# EAGLE design Tester (EAGLE 6.5.0)
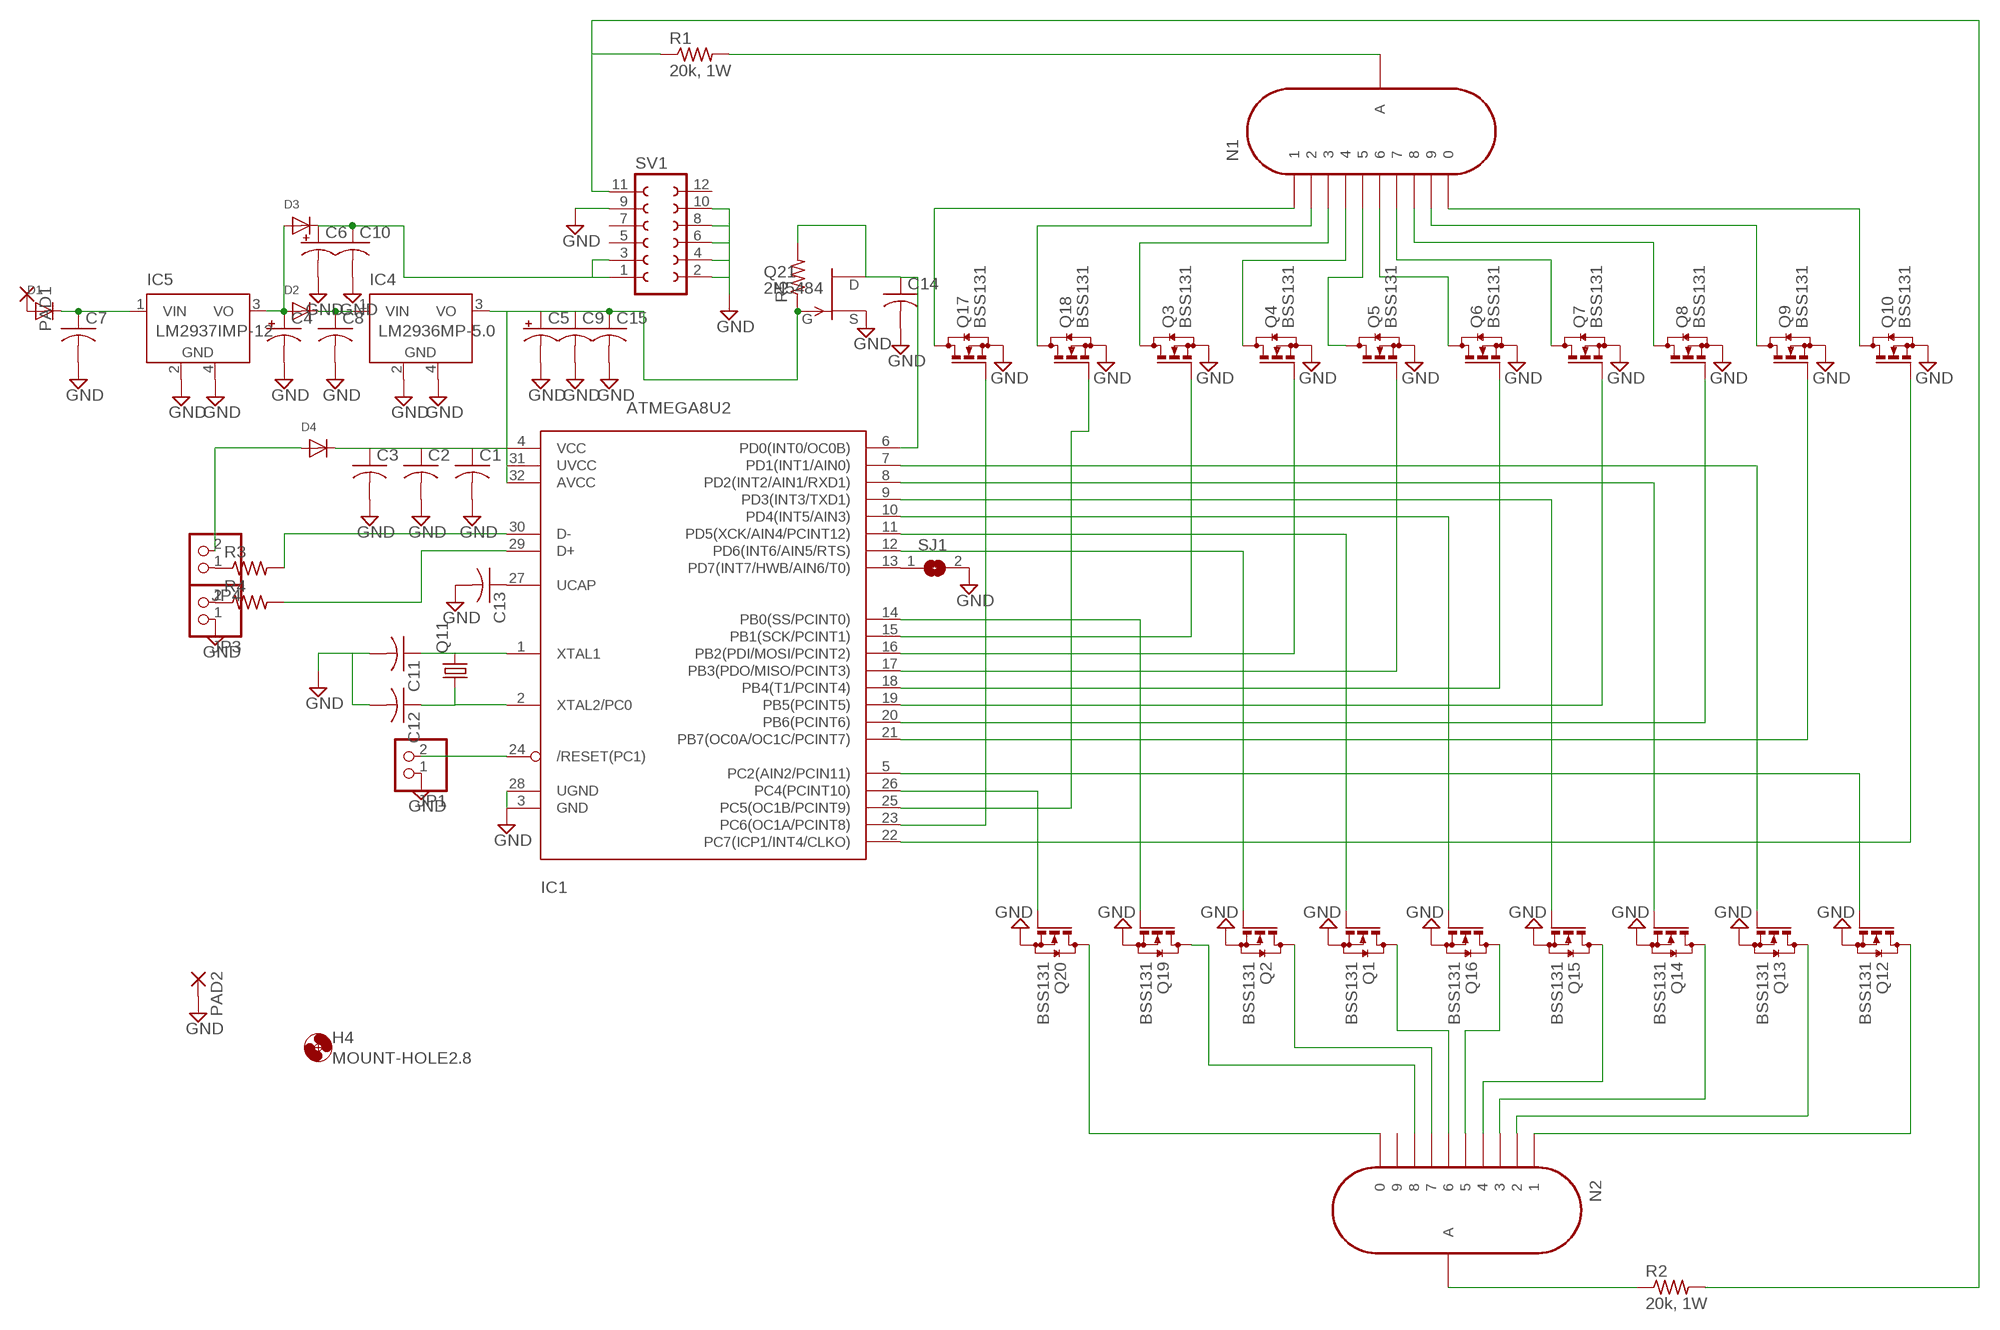
[diagram p0: schematic, sheet 1]

## Parts
C1  C-USC0603K  [C0603K]
C2  C-USC0603K  [C0603K]
C3  C-USC0603K  [C0603K]
C4  CPOL-USE3.5-8  [E3,5-8]
C5  CPOL-USE3.5-8  [E3,5-8]
C6  CPOL-USE3.5-8  [E3,5-8]
C7  C-USC1206K  [C1206K]
C8  C-USC1206K  [C1206K]
C9  C-USC1206K  [C1206K]
C10  C-USC1206K  [C1206K]
C11  C-USC1206K  [C1206K]
C12  C-USC1206K  [C1206K]
C13  C-USC1206K  [C1206K]
C14  C-USC1206K  [C1206K]
C15  C-USC1206K  [C1206K]
D1  DIODESMA  [SMADIODE]
D2  DIODESMA  [SMADIODE]
D3  DIODESMA  [SMADIODE]
D4  DIODESOD-123  [SOD-123]
H4  MOUNT-HOLE2.8  [2,8]
IC1  ATMEGA8U2  ATMEGA32U2-TQFP  [TQFP32-08]
IC4  LM2936MP-5.0  [SOT223]
IC5  LM2937IMP-12  LM2936MP-5.0  [SOT223]
JP1  PINHD-1X2  [1X02]
JP3  PINHD-1X2  [1X02]
JP4  PINHD-1X2  [1X02]
N1  IN-12A  [IN-12]
N2  IN-12A  [IN-12]
PAD1  3,81/1,4  [3,81/1,4]
PAD2  3,81/1,4  [3,81/1,4]
Q1  BSS131  BSS123  [SOT23]
Q2  BSS131  BSS123  [SOT23]
Q3  BSS131  BSS123  [SOT23]
Q4  BSS131  BSS123  [SOT23]
Q5  BSS131  BSS123  [SOT23]
Q6  BSS131  BSS123  [SOT23]
Q7  BSS131  BSS123  [SOT23]
Q8  BSS131  BSS123  [SOT23]
Q9  BSS131  BSS123  [SOT23]
Q10  BSS131  BSS123  [SOT23]
Q11  CRYSTALHC49S  [HC49/S]
Q12  BSS131  BSS123  [SOT23]
Q13  BSS131  BSS123  [SOT23]
Q14  BSS131  BSS123  [SOT23]
Q15  BSS131  BSS123  [SOT23]
Q16  BSS131  BSS123  [SOT23]
Q17  BSS131  BSS123  [SOT23]
Q18  BSS131  BSS123  [SOT23]
Q19  BSS131  BSS123  [SOT23]
Q20  BSS131  BSS123  [SOT23]
Q21  2N5484  [TO92-]
R1  20k, 1W  R-US_0309/12  [0309/12]
R2  20k, 1W  R-US_0309/V  [0309V]
R3  R-US_R0805  [R0805]
R4  R-US_R0805  [R0805]
R5  R-US_R0805  [R0805]
SJ1  SJ  [SJ]
SV1  FE06-2  [FE06-2]

## Nets
GND: C1.2 C2.2 C3.2 C4.- C5.- C6.- C7.2 C8.2 C9.2 C10.2 C11.2 C12.2 C13.2 C14.2 C15.2 IC1.3(GND) IC1.28(UGND) IC4.2(GND) IC4.4(GND) IC5.2(GND) IC5.4(GND) JP1.1 JP3.1 PAD2.1(P) Q1.2(S) Q2.2(S) Q3.2(S) Q4.2(S) Q5.2(S) Q6.2(S) Q7.2(S) Q8.2(S) Q9.2(S) Q10.2(S) Q12.2(S) Q13.2(S) Q14.2(S) Q15.2(S) Q16.2(S) Q17.2(S) Q18.2(S) Q19.2(S) Q20.2(S) Q21.2(S) SJ1.2 SV1.2 SV1.4 SV1.6 SV1.8 SV1.9 SV1.10
N$1: IC1.15(PB1(SCK/PCINT1)) Q3.1(G)
N$2: IC1.8(PD2(INT2/AIN1/RXD1)) Q14.1(G)
N$3: IC1.9(PD3(INT3/TXD1)) Q15.1(G)
N$4: IC1.10(PD4(INT5/AIN3)) Q16.1(G)
N$5: IC1.16(PB2(PDI/MOSI/PCINT2)) Q4.1(G)
N$6: IC1.17(PB3(PDO/MISO/PCINT3)) Q5.1(G)
N$7: IC1.26(PC4(PCINT10)) Q20.1(G)
N$8: IC1.14(PB0(SS/PCINT0)) Q19.1(G)
N$9: IC1.12(PD6(INT6/AIN5/RTS)) Q2.1(G)
N$10: IC1.11(PD5(XCK/AIN4/PCINT12)) Q1.1(G)
N$11: IC1.5(PC2(AIN2/PCIN11)) Q12.1(G)
N$12: IC1.18(PB4(T1/PCINT4)) Q6.1(G)
N$13: IC1.19(PB5(PCINT5)) Q7.1(G)
N$14: IC1.7(PD1(INT1/AIN0)) Q13.1(G)
N$15: IC1.25(PC5(OC1B/PCINT9)) Q18.1(G)
N$16: IC1.23(PC6(OC1A/PCINT8)) Q17.1(G)
N$17: IC1.22(PC7(ICP1/INT4/CLKO)) Q10.1(G)
N$18: IC1.21(PB7(OC0A/OC1C/PCINT7)) Q9.1(G)
N$19: IC1.20(PB6(PCINT6)) Q8.1(G)
N$20: C1.1 C2.1 C3.1 C5.+ C9.1 C15.1 D4.C IC1.4(VCC) IC1.31(UVCC) IC1.32(AVCC) IC4.3(VO) Q21.1(G) R5.1
N$21: C7.1 D1.C IC5.1(VIN)
N$22: C4.+ D2.A D3.A IC5.3(VO)
N$23: C8.1 D2.C IC4.1(VIN)
N$24: C6.+ C10.1 D3.C SV1.1 SV1.3
N$25: C11.1 IC1.1(XTAL1) Q11.2
N$26: C12.1 IC1.2(XTAL2/PC0) Q11.1
N$27: D1.A PAD1.1(P)
N$28: N1.1 Q17.3(D)
N$29: N1.2 Q18.3(D)
N$30: N1.3 Q3.3(D)
N$31: N1.4 Q4.3(D)
N$32: N1.5 Q5.3(D)
N$33: N1.0 Q10.3(D)
N$34: N1.9 Q9.3(D)
N$35: N1.8 Q8.3(D)
N$36: N1.7 Q7.3(D)
N$37: N1.6 Q6.3(D)
N$38: R1.1 R2.2 SV1.11
N$39: JP3.2 R4.1
N$40: N2.A R2.1
N$41: N2.0 Q20.3(D)
N$42: N2.1 Q12.3(D)
N$43: N2.2 Q13.3(D)
N$44: JP4.1 R3.1
N$45: N2.3 Q14.3(D)
N$46: N2.4 Q15.3(D)
N$47: N2.5 Q16.3(D)
N$48: N2.6 Q1.3(D)
N$49: N2.7 Q2.3(D)
N$50: N2.8 Q19.3(D)
N$51: N1.A R1.2
N$52: IC1.24(/RESET(PC1)) JP1.2
N$53: IC1.29(D+) R4.2
N$54: D4.A JP4.2
N$55: C13.1 IC1.27(UCAP)
N$56: IC1.30(D-) R3.2
N$57: IC1.13(PD7(INT7/HWB/AIN6/T0)) SJ1.1
N$58: C14.1 IC1.6(PD0(INT0/OC0B)) Q21.3(D) R5.2
Unconnected: N2.9 SV1.5 SV1.7 SV1.12

## Library data of the parts
C1-C3 C7-C15 = adafruit:C-US: CAPACITOR, American symbol
C4-C6 = adafruit:CPOL-US: POLARIZED CAPACITOR, American symbol
D1-D4 = adafruit:DIODE: Diode SMADIODE - SMA Surface Mount Package 20V 1A Schottky Diode Digikey: 641-1014-6-ND DO-1N4148 - Through Hole Small Current Diode SOD-123 20V 1 A (.5mV Vf) Schottky Diode - Digikey: MBRX120TPMSCT-ND SOD-323 10V 570mA (.38mV Vf, 3ns) Schottky Diode - Digikey: ZLLS410CT-ND SOD-523 30V 30mA Schottky Diode (RB751S-40TE61) - Digikey: RB751S-40TE61CT-ND SOT23-R/W - SOT23 Package (R = Solder Paste/Reflow Ovens, W = Hand-Soldering) BAT54Film 40V 300mA - Digikey: 497-7162-1-ND
H4 = holes:MOUNT-HOLE: MOUNTING HOLE with drill center marker
IC1 = adafruit:ATMEGA32U2: ATmega32u2 Pin compatible with the atmega8u2, atmega16u2 and atmega32u2 8, 16 or 32 K flash, 1K RAM, 512b EEPROM 8 bit and 16 bit timer (5 PWM total) UART, SPI (no I2C!) USB with 4 endpoints, LUFA compatible 22 I/O lines, analog comparator (no ADC!) Comes with DFU bootloader burned in!
IC4 IC5 = national-semiconductor:LM2936MP?*: Ultra-Low Quiescent Current LDO Voltage Regulator Source: Data sheet <http://www.national.com/ds/LM/LM2936.pdf>; MF: NATIONAL SEMICONDUCTOR; MPN: LM2936MP-5.0/NOPB; OC_FARNELL: 1469063; OC_NEWARK: 41K4524
JP1 JP3 JP4 = pinhead:PINHD-1X2: PIN HEADER
N1 N2 = BnixiesTEST:IN-12A: IN-12A: medium numeric topview nixie tube
PAD1 PAD2 = wirepad:3,81/1,4: THROUGH-HOLE PAD
Q1-Q10 Q12-Q20 = transistor-small-signal:BSS123: N-CHANNEL MOS FET
Q11 = crystal:CRYSTAL: CRYSTAL; OC_FARNELL: 1667008; OC_NEWARK: unknown
Q21 = transistor-fet:?548*: N-Channel JFETs Source: VISHAY 2N5484.pdf Compatible: TO92 2N5245 J304 J305 U310 J308 J309 J310 TO72 2N4416 2N4416A 2N3823 2N4351 3N169 3N170 3N171 MFE3002 TO18 2N3796 2N3797 MFE825 Source: Motorola European Master Guide Pacge 3-59
R1 R2 = resistor:R-US_: RESISTOR, American symbol
R3-R5 = adafruit:R-US_: RESISTOR, American symbol
SJ1 = jumper:SJ: SMD solder JUMPER
SV1 = con-lsta:FE06-2: FEMALE HEADER; OC_FARNELL: unknown; OC_NEWARK: unknown

## Board
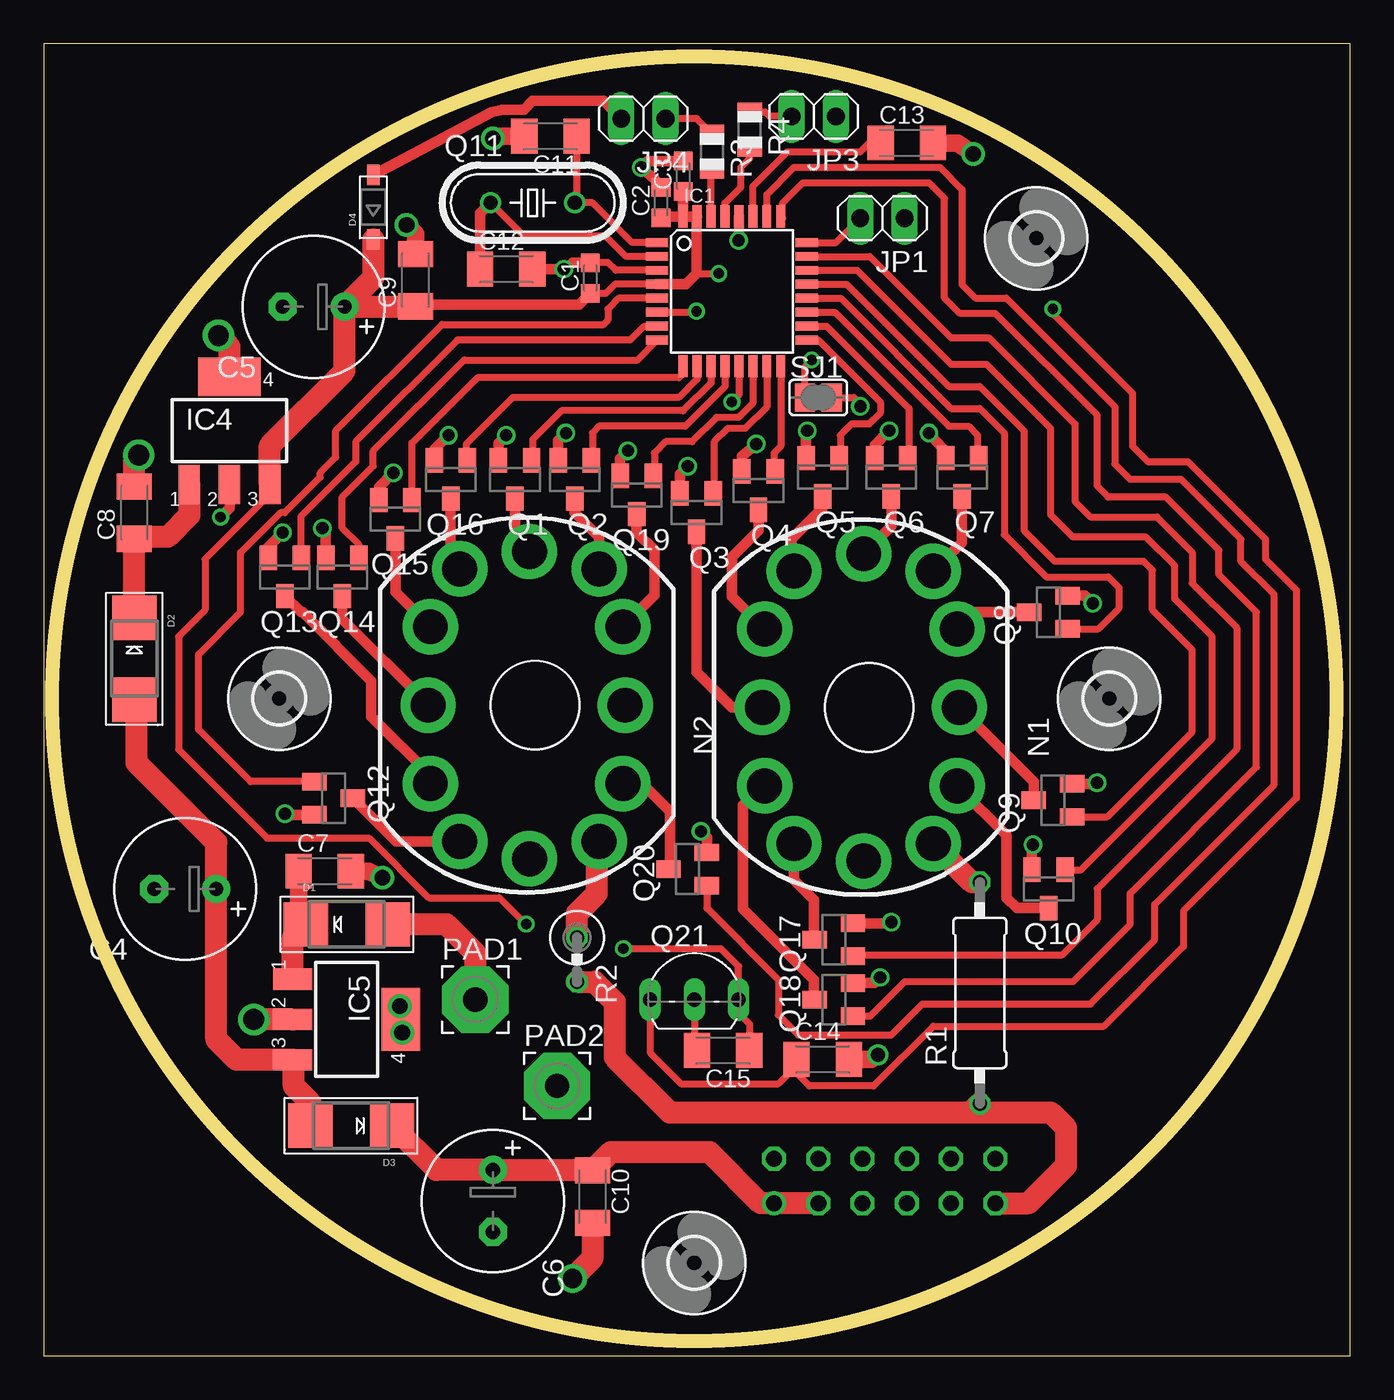
[diagram p1: board, top side]
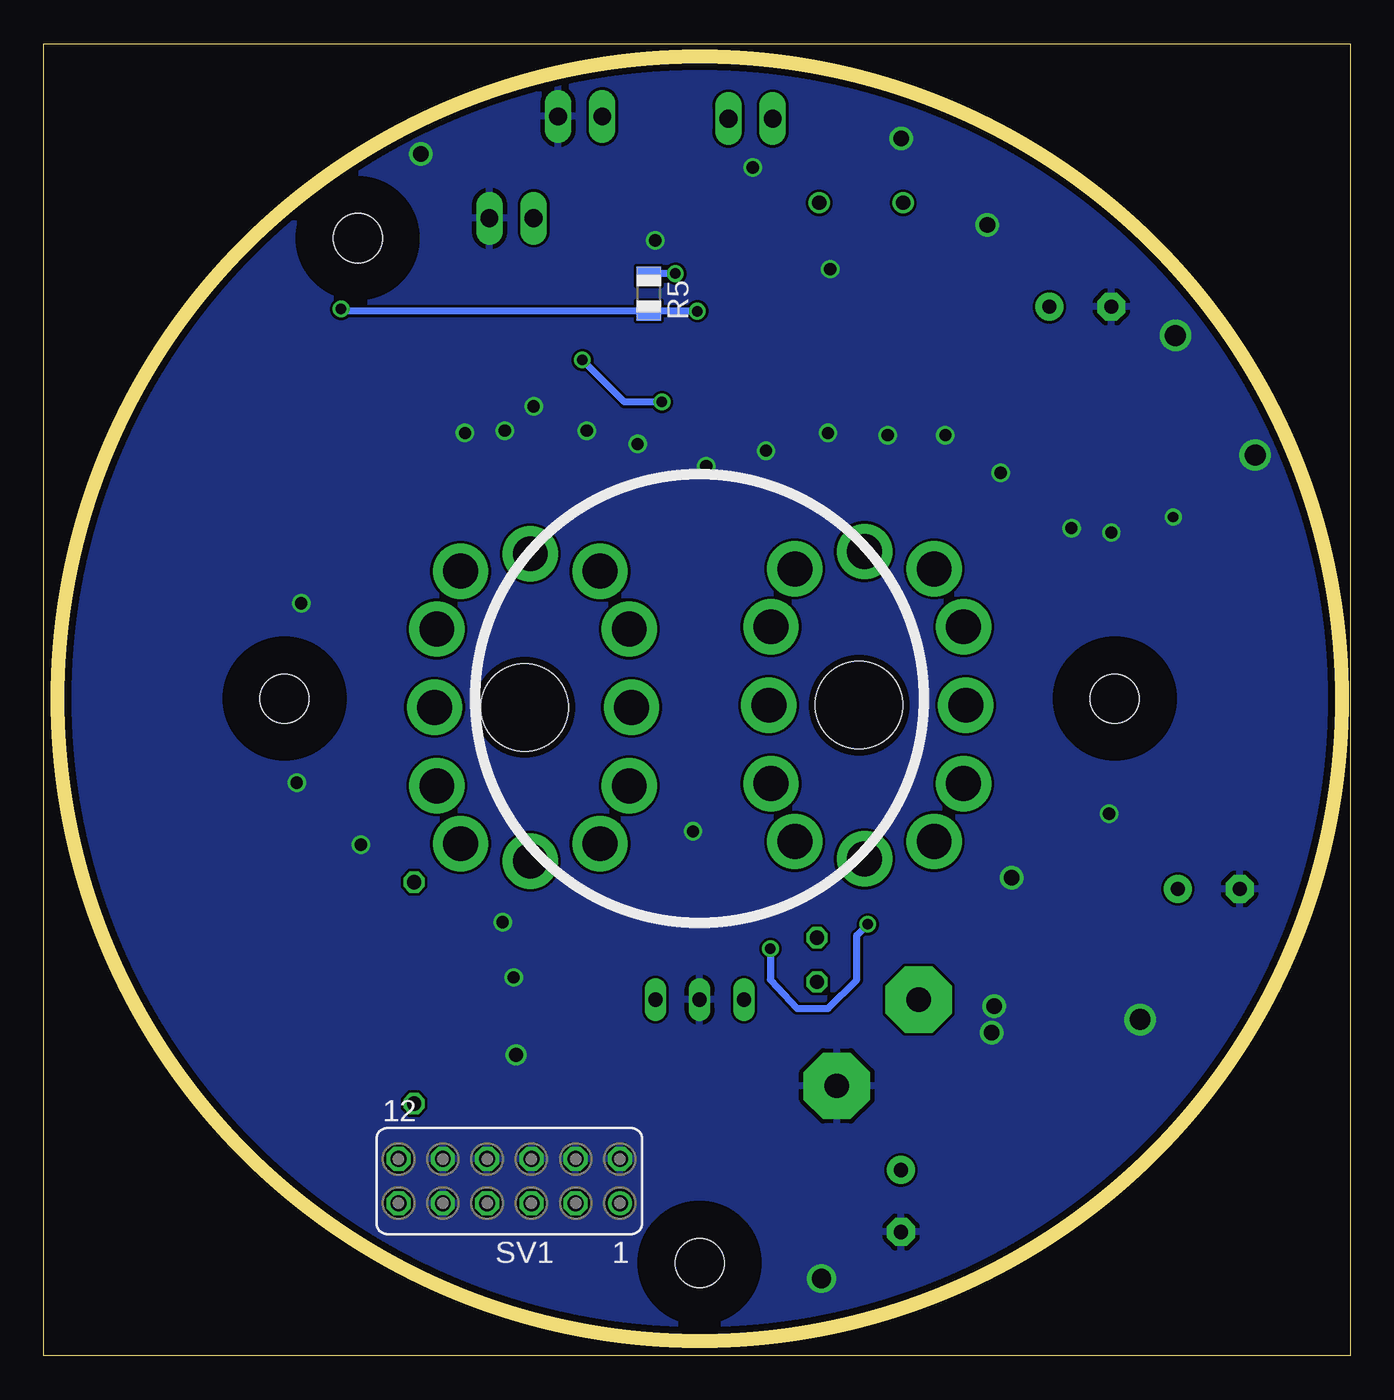
[diagram p2: board, bottom side, seen from below]

Size 74.98 x 75.3 mm. Coordinates in mm from the lower left corner, seen from the top.
Outline: 0,0 74.98,0 74.98,75.3 0,75.3 0,0
Outline: circle at 37.34,37.72 radius 36.83
Copper layers (1*16): Top 0.0356mm / dielectric 1.5011mm / Bottom 0.0356mm
Design rules "LaenPCBOrder": minimum track width 6mil, minimum drill 13mil, track to track 6mil, track to pad 6mil, pad to pad 6mil, via to via 6mil, smd to smd 6mil, copper to edge 15mil, drill to drill 6mil, minimum pad ring 7mil, minimum via ring 7mil, stop-mask expansion 4mil, vias tented up to drill 0mil, thermal gap 10mil

### Footprints (pad centres in the part's own frame; a part is rotated, then mirrored left to right if it is on the bottom)
C0603K = smd 1.05 x 1.08: 1 -0.875,0; 2 0.875,0
E3,5-8 = drill 0.813 pad 1.6: + -1.778,0 | drill 0.813 pad 1.6 octagon: - 1.778,0
C1206K = smd 1.5 x 2: 1 -1.5,0; 2 1.5,0
SMADIODE = smd 2.54 x 2.54: A 2.349,0; C -2.349,0
SOD-123 = smd 1.2 x 0.7: A 1.85,0; C -1.85,0
2,8 = hole 2.8: 0,0
TQFP32-08 = smd 1.27 x 0.508: 1 -4.293,2.8; 2 -4.293,2; 3 -4.293,1.2; 4 -4.293,0.4; 5 -4.293,-0.4; 6 -4.293,-1.2; 7 -4.293,-2; 8 -4.293,-2.8; 17 4.293,-2.8; 18 4.293,-2; 19 4.293,-1.2; 20 4.293,-0.4; 21 4.293,0.4; 22 4.293,1.2; 23 4.293,2; 24 4.293,2.8 | smd 0.508 x 1.27: 9 -2.8,-4.293; 10 -2,-4.293; 11 -1.2,-4.293; 12 -0.4,-4.293; 13 0.4,-4.293; 14 1.2,-4.293; 15 2,-4.293; 16 2.8,-4.293; 25 2.8,4.293; 26 2,4.293; 27 1.2,4.293; 28 0.4,4.293; 29 -0.4,4.293; 30 -1.2,4.293; 31 -2,4.293; 32 -2.8,4.293
SOT223 = smd 1.219 x 2.235: 1 -2.311,-3.099; 2 0,-3.099; 3 2.311,-3.099 | smd 3.6 x 2.2: 4 0,3.099
1X02 = drill 1.016 long: 1 -1.27,0; 2 1.27,0
IN-12 = drill 2 pad 3.175: 0 5.048,-4.5; 1 -4.317,-7.817; 2 -6,-4.5; 3 -6.127,0; 4 -6,4.5; 5 -4.317,7.817; 6 -0.318,8.818; 7 3.683,7.817; 8 5.048,4.5; 9 5.175,0; A 3.683,-7.817; LHDP -0.318,-8.818 | hole 5: 0,0
3,81/1,4 = drill 1.397 pad 3.81 octagon: 1 0,0
SOT23 = smd 1 x 1.4: 1 -0.95,-1.1; 2 0.95,-1.1; 3 0,1.1
HC49/S = drill 0.813: 1 -2.413,0; 2 2.413,0
TO92- = drill 0.813 long: 1 2.54,0; 2 0,0; 3 -2.54,0
0309/12 = drill 0.813 octagon: 1 -6.35,0; 2 6.35,0
0309V = drill 0.813 octagon: 1 -1.27,0; 2 1.27,0
R0805 = smd 1.1 x 1.4: 1 -1,0; 2 1,0
SJ = smd 1.168 x 1.6: 1 -0.762,0; 2 0.762,0
FE06-2 = drill 0.914: 1 -6.35,1.27 | drill 0.914 octagon: 2 -6.35,-1.27; 3 -3.81,1.27; 4 -3.81,-1.27; 5 -1.27,1.27; 6 -1.27,-1.27; 7 1.27,1.27; 8 1.27,-1.27; 9 3.81,1.27; 10 3.81,-1.27; 11 6.35,1.27; 12 6.35,-1.27

### Placement (x,y rotation side)
C1  31.37,61.85 90 top
C2  35.43,66.17 90 top
C3  36.7,67.69 90 top
C4  8.13,26.8 180 top
C5  15.49,60.2 180 top
C6  25.78,8.89 270 top
C7  16.13,27.81 0 top
C8  5.21,48.39 90 top
C9  21.34,61.72 90 top
C10  31.5,9.14 270 top
C11  29.08,69.98 180 top
C12  26.54,62.36 0 top
C13  49.53,69.6 0 top
C14  44.7,17.02 0 top
C15  38.99,17.53 180 top
D1  17.4,24.77 0 top
D2  5.21,40.01 270 top
D3  17.65,13.21 180 top
D4  18.92,65.91 90 top
H1  MOUNT-HOLE2.8  [2,8]  61.15,37.72 0 top
H2  MOUNT-HOLE2.8  [2,8]  13.53,37.72 0 top
H3  MOUNT-HOLE2.8  [2,8]  37.34,5.33 0 top
H4  56.96,64.14 0 top
IC1  39.5,61.09 0 top
IC4  10.67,53.09 0 top
IC5  17.4,19.3 270 top
JP1  48.13,65.28 180 top
JP3  44.2,71.12 180 top
JP4  34.42,70.99 180 top
N1  47.37,37.21 0 top
N2  28.19,37.34 0 top
PAD1  24.77,20.45 0 top
PAD2  29.46,15.49 0 top
Q1  27.05,50.29 180 top
Q2  30.48,50.29 180 top
Q3  37.47,48.39 180 top
Q4  41.02,49.66 180 top
Q5  44.7,50.42 180 top
Q6  48.64,50.42 180 top
Q7  52.7,50.42 180 top
Q8  57.66,42.67 90 top
Q9  57.91,31.88 90 top
Q10  57.66,26.8 180 top
Q11  28.07,66.17 0 top
Q12  16.64,32 270 top
Q13  13.84,44.7 180 top
Q14  17.14,44.7 180 top
Q15  20.19,48.01 180 top
Q16  23.37,50.29 180 top
Q17  45.34,23.88 90 top
Q18  45.34,20.45 90 top
Q19  34.04,49.4 180 top
Q20  36.96,27.94 90 top
Q21  37.34,20.45 0 top
R1  53.72,20.83 90 top
R2  30.61,22.73 270 top
R3  38.35,69.09 270 top
R4  40.51,70.36 270 top
R5  40.26,60.96 270 bottom
SJ1  44.45,54.99 0 top
SV1  48.26,10.03 180 bottom

### Tracks (layer width: path | path; a pad name or v marks a point on that pad's centre or on a via)
GND  (via drill 0.6, 0.7, 0.8, 0.9, 1.1, 1.2)
  Top 0.406: IC1.3 32.84,62.29 32.38,62.74 31.38,62.74 C1.2 | Q21.2 37.34,17.68 C15.2 | SJ1.2 46.48,54.99 v46.86,54.48
  Top 0.61: IC4.2 10.67,48.64 v10.16,48.13 | Q12.2 13.9,31.05 v13.84,31.11 | Q14.2 16.2,47.3 v16,47.5 | Q13.2 12.89,46.42 v13.72,47.24 | Q15.2 19.24,49.85 v20.07,50.67 | Q16.2 22.42,52.01 v23.24,52.83 | Q1.2 26.1,52.39 v26.54,52.83 | Q19.2 33.09,51.5 v33.53,51.94 | Q3.2 36.52,50.61 v36.96,51.05 | Q4.2 40.07,51.62 v40.89,52.32 | Q6.2 47.69,52.26 v48.51,53.09 | Q7.2 51.76,51.88 v50.8,52.96 | Q8.2 59.76,43.62 v60.2,43.18 | Q9.2 60.39,32.83 v60.45,32.89 | Q10.2 56.71,29.28 v56.77,29.34 | Q17.2 48.58,24.83 v48.64,24.89 | Q18.2 47.69,21.4 v48.01,21.72 | Q20.2 38.06,29.76 v37.72,30.1 | C2.2 35.43,67.18 v34.29,68.2 34.66,68.57 C3.2 | IC1.28 39.9,64.03 v39.88,64.01 | Q2.2 29.53,52.52 v29.97,52.96 | C12.2 v29.84,62.36 29.97,62.36 30.35,62.74 31.36,62.74 C1.2 | Q5.2 43.75,53.02 v43.81,53.09
  Top 1.016: C14.2 47.5,17.02 v47.88,17.27 | C7.2 18.67,27.81 v19.43,27.43 | C9.2 21.34,64.39 v20.83,64.9 | C11.2 25.91,69.98 v25.78,69.85 | C13.2 52.45,69.6 v53.34,68.96
  Top 1.27: C8.2 5.21,51.44 v5.46,51.69 | IC4.4 10.67,57.91 v10.03,58.55 | IC5.2 v12.06,19.3 | IC5.4 20.5,20.02 v20.45,20.07 20.45,18.67 v20.57,18.54 20.57,18.41 | C10.2 31.5,5.59 v30.35,4.45
  pour Bottom: 0.25,74.93 74.68,74.93 74.68,0.25 0.25,0.25
N$1
  Top 0.406: Q3.1 38.48,49.55 38.48,52.45 39.24,53.21 40.26,53.21 41.5,54.45 IC1.15
N$2
  Top 0.406: IC1.8 34.07,57.15 24.13,57.15 18.92,51.94 18.92,51.05 17.14,49.28 17.14,47.5 18.09,46.55 Q14.1
N$3
  Top 0.406: IC1.9 36.7,56.38 36.45,56.13 24.89,56.13 21.14,52.38 Q15.1
N$4
  Top 0.406: IC1.10 37.5,56.04 36.45,54.99 26.92,54.99 24.26,52.32 24.26,51.45 Q16.1
N$5
  Top 0.406: IC1.16 42.3,52.2 41.91,51.82 41.91,50.82 Q4.1
N$6
  Top 0.406: IC1.17 44.46,58.29 48.01,54.74 48.01,54.1 47.37,53.47 46.35,53.47 45.72,52.83 45.72,51.59 Q5.1
N$7
  Top 0.406: IC1.26 41.5,66.64 43.05,68.2 51.44,68.2 52.7,66.93 52.7,61.47 53.47,60.71 55.24,60.71 61.47,54.48 61.47,51.18 62.36,50.29 65.28,50.29 68.71,46.86 68.71,45.59 70.61,43.69 70.61,32.77 63.75,25.91 63.75,23.88 60.07,20.19 50.42,20.19 48.64,18.41 43.31,18.41 42.16,19.56 42.16,21.59 38.06,25.7 Q20.1
N$8
  Top 0.406: IC1.14 40.7,54.67 39.88,53.85 38.61,53.85 37.21,52.45 35.69,52.45 35.05,51.82 35.05,50.57 Q19.1
N$9
  Top 0.406: IC1.12 39.1,55.61 36.83,53.34 31.88,53.34 31.5,52.96 31.5,51.46 Q2.1
N$10
  Top 0.406: IC1.11 38.3,55.82 36.7,54.23 29.72,54.23 28.07,52.58 28.07,51.46 Q1.1
N$11
  Top 0.406: 35.19,60.71 IC1.5 33,60.69 32.38,60.07 32.38,59.44 32.13,59.18 22.86,59.18 16.76,53.09 16.76,51.56 15.88,50.67 15.88,50.42 13.84,48.39 13.59,48.39 11.3,46.1 11.3,42.67 8.89,40.26 8.89,35.94 11.88,32.95 Q12.1
N$12
  Top 0.406: IC1.18 44.93,59.09 49.66,54.36 49.66,51.59 Q6.1
N$13
  Top 0.406: IC1.19 45.4,59.89 51.94,53.34 53.09,53.34 53.59,52.83 53.59,51.58 Q7.1
N$14
  Top 0.406: IC1.7 35.17,59.05 34.42,59.05 33.66,58.29 23.75,58.29 17.91,52.45 17.91,51.31 14.79,48.19 Q13.1
N$15
  Top 0.406: IC1.25 42.4,65.28 42.4,66.15 43.56,67.31 50.8,67.31 51.69,66.42 51.69,60.71 52.58,59.82 54.61,59.82 60.45,53.98 60.45,49.91 61.09,49.28 64.39,49.28 67.44,46.23 67.44,44.83 69.6,42.67 69.6,33.78 62.36,26.54 62.36,24.77 59.05,21.46 49.4,21.46 47.44,19.5 Q18.1
N$16
  Top 0.406: IC1.23 47.4,63.09 52.07,58.42 54.23,58.42 59.18,53.47 59.18,49.02 60.07,48.13 63.88,48.13 65.91,46.1 65.91,44.32 68.45,41.78 68.45,34.8 60.45,26.8 60.45,25.02 58.42,22.99 46.5,22.99 Q17.1
N$17
  Top 0.406: IC1.22 46.68,62.29 52.07,56.9 54.1,56.9 57.78,53.21 57.78,48.26 59.05,46.99 63.25,46.99 64.9,45.34 64.9,43.43 67.06,41.27 67.06,35.43 59.52,27.9 Q10.1
N$18
  Top 0.406: IC1.21 46.08,61.49 51.94,55.63 53.72,55.63 56.26,53.09 56.26,47.37 58.04,45.59 63.12,45.59 63.63,45.09 63.63,42.8 65.91,40.51 65.91,35.81 61.03,30.93 Q9.1
N$19
  Top 0.406: IC1.20 45.74,60.69 52.07,54.36 53.72,54.36 55.12,52.96 55.12,47.12 57.53,44.7 61.09,44.7 61.72,44.07 61.72,42.93 60.52,41.72 Q8.1
N$20  (via drill 0.6)
  Top 0.406: IC1.4 32.78,61.49 32.26,60.96 31.38,60.96 C1.1 | IC4.3 12.98,49.43 9.27,45.72 9.27,42.8 7.75,41.27 7.75,34.8 12.83,29.72 18.67,29.72 22.1,26.29 26.16,26.29 v27.69,24.77 | v33.27,23.37 38.86,23.37 39.88,22.35 Q21.1 39.88,19.68 40.51,19.05 40.51,17.55 C15.1 | 37.47,62.1 v38.73,62.1
  Top 0.61: C9.1 21.44,60.33 30.72,60.33 C1.1 | C3.1 IC1.32 | IC1.32 35.52,65.38 C2.1 | IC1.32 IC1.31 37.47,65.35 37.47,62.1 36.85,61.49 IC1.4
  Top 1.27: C5.+ 21.31,60.2 C9.1 | D4.C 18.92,61.85 C5.+ | IC4.3 12.98,52.22 17.27,56.52 C5.+
  Bottom 0.406: v33.27,23.37 33.27,21.59 31.75,19.94 29.97,19.94 28.32,21.59 28.32,24.13 v27.69,24.77 | v38.73,62.1 40.12,62.1 R5.1
N$21
  Top 1.016: C7.1 14.63,25.19
  Top 1.27: 14.63,25.19 D1.C 14.3,24.02 IC5.1
N$22
  Top 1.27: D2.A 5.33,37.53 5.33,34.04 9.91,29.46 C4.+ 9.91,18.16 11.07,16.99 IC5.3 14.35,16.94 14.35,15.49 15.3,14.54 D3.A 14.92,12.83 14.86,12.83 14.94,12.9
N$23
  Top 1.27: D2.C C8.1 5.31,46.99 7.11,46.99 8.36,48.23 IC4.1
N$24
  Top 1.27: D3.C 22.54,10.67 C6.+ 31.47,10.67 C10.1 32.54,11.68 38.23,11.68 41.15,8.76 SV1.1 SV1.3
N$25
  Top 0.406: IC1.1 33.78,63.89 31.5,66.17 Q11.2 30.58,66.27 C11.1
N$26
  Top 0.406: IC1.2 33.43,63.09 32.26,64.26 27.56,64.26 Q11.1
  Top 0.61: C12.1 25.04,65.56 Q11.1
N$27
  Top 1.27: D1.A 23.11,24.77 24.77,23.11 PAD1.1
N$28
  Top 0.61: N1.1 43.05,27.3 44.2,26.16 44.2,23.92 Q17.3
N$29
  Top 0.61: N1.2 41.22,32.71 40.13,31.62 40.13,25.65 44.2,21.59 44.2,20.49 Q18.3
N$30
  Top 0.61: Q3.3 37.47,39.24 39.5,37.21 N1.3
N$31
  Top 0.61: Q4.3 41.02,47.37 39.5,45.85 39.5,43.59 N1.4
N$32
  Top 0.61: Q5.3 44.7,48.64 42.93,46.86 42.93,45.16 N1.5
N$33
  Top 0.61: Q10.3 55.84,25.7 55.24,26.29 55.24,29.88 N1.0
N$34
  Top 0.61: Q9.3 56.81,32.94 N1.9
N$35
  Top 0.61: Q8.3 53.38,42.67 N1.8
N$36
  Top 0.61: Q7.3 52.7,46.68 N1.7
N$37
  Top 0.61: Q6.3 48.64,47.62 N1.6
N$38
  Top 1.27: R2.2 31.62,21.46 32.77,20.32 32.77,17.14 35.94,13.97 53.21,13.97 | 53.21,13.97 R1.1 | 53.21,13.97 57.78,13.97 58.67,13.08 58.67,10.92 56.52,8.76 SV1.11
N$39
  Top 0.406: JP3.2 41.66,71.12 41.4,71.37 40.53,71.37 R4.1
N$40
  Top 1.27: R2.1 30.61,25.4 31.75,26.54 31.75,29.39 N2.A
N$41
  Top 0.61: N2.0 34.34,32.84 35.94,31.24 35.94,28.02 Q20.3
N$42
  Top 0.61: Q12.3 20.22,29.52 N2.1
N$43
  Top 0.61: N2.2 22.19,33.3 18.8,36.7 18.8,38.73 14.86,42.67 14.78,42.67 Q13.3
N$44
  Top 0.406: R3.1 38.35,70.1 37.47,70.99 JP4.1
N$45
  Top 0.61: N2.3 22.07,37.37 17.14,42.29 Q14.3
N$46
  Top 0.61: Q15.3 20.19,43.84 N2.4
N$47
  Top 0.61: Q16.3 23.37,45.66 N2.5
N$48
  Top 0.61: Q1.3 27.05,46.98 N2.6
N$49
  Top 0.61: Q2.3 30.48,48.39 31.88,46.99 N2.7 | N2.7
N$50
  Top 0.61: Q19.3 34.04,47.24 35.05,46.23 35.05,43.65 N2.8
N$51
  Top 1.27: R1.2 53.27,27.18 N1.A
N$52
  Top 0.406: IC1.24 45.47,63.89 JP1.2
N$53
  Top 0.406: IC1.29 39.1,66.15 40.01,67.06 40.01,68.2 40.51,68.71 R4.2
N$54
  Top 0.61: D4.A 25.71,71.37 26.34,71.5 27.56,71.5 28.07,72.01 32.13,72.01 JP4.2
N$55
  Top 0.406: IC1.27 40.7,67.11 42.67,69.09 46.86,69.09 47.37,69.6 C13.1 48.13,69.72
N$56
  Top 0.406: IC1.30 38.3,68.03 R3.2
N$57  (via drill 0.6)
  Top 0.406: IC1.13 39.9,55.14 v39.5,54.74 | SJ1.1 43.69,56.77 v44.07,57.15
  Bottom 0.406: v39.5,54.74 41.66,54.74 v44.07,57.15
N$58  (via drill 0.6)
  Top 0.406: v57.91,60.07 57.91,59.82 62.48,55.24 62.48,52.2 63.37,51.31 65.66,51.31 70.1,46.86 70.1,45.72 71.88,43.94 71.88,32 65.41,25.53 65.41,23.5 60.83,18.92 51.05,18.92 47.62,15.49 43.94,15.49 42.99,16.45 | IC1.6 37.41,59.89 v37.47,59.94 | Q21.3 34.8,17.4 36.58,15.62 42.16,15.62 42.99,16.45 | C14.1 43.2,16.66 42.99,16.45
  Bottom 0.406: v57.91,60.07 57.8,59.96 R5.2 40.24,59.94 v37.47,59.94